# Altium project anti_theft_device_pcb.PrjPcb
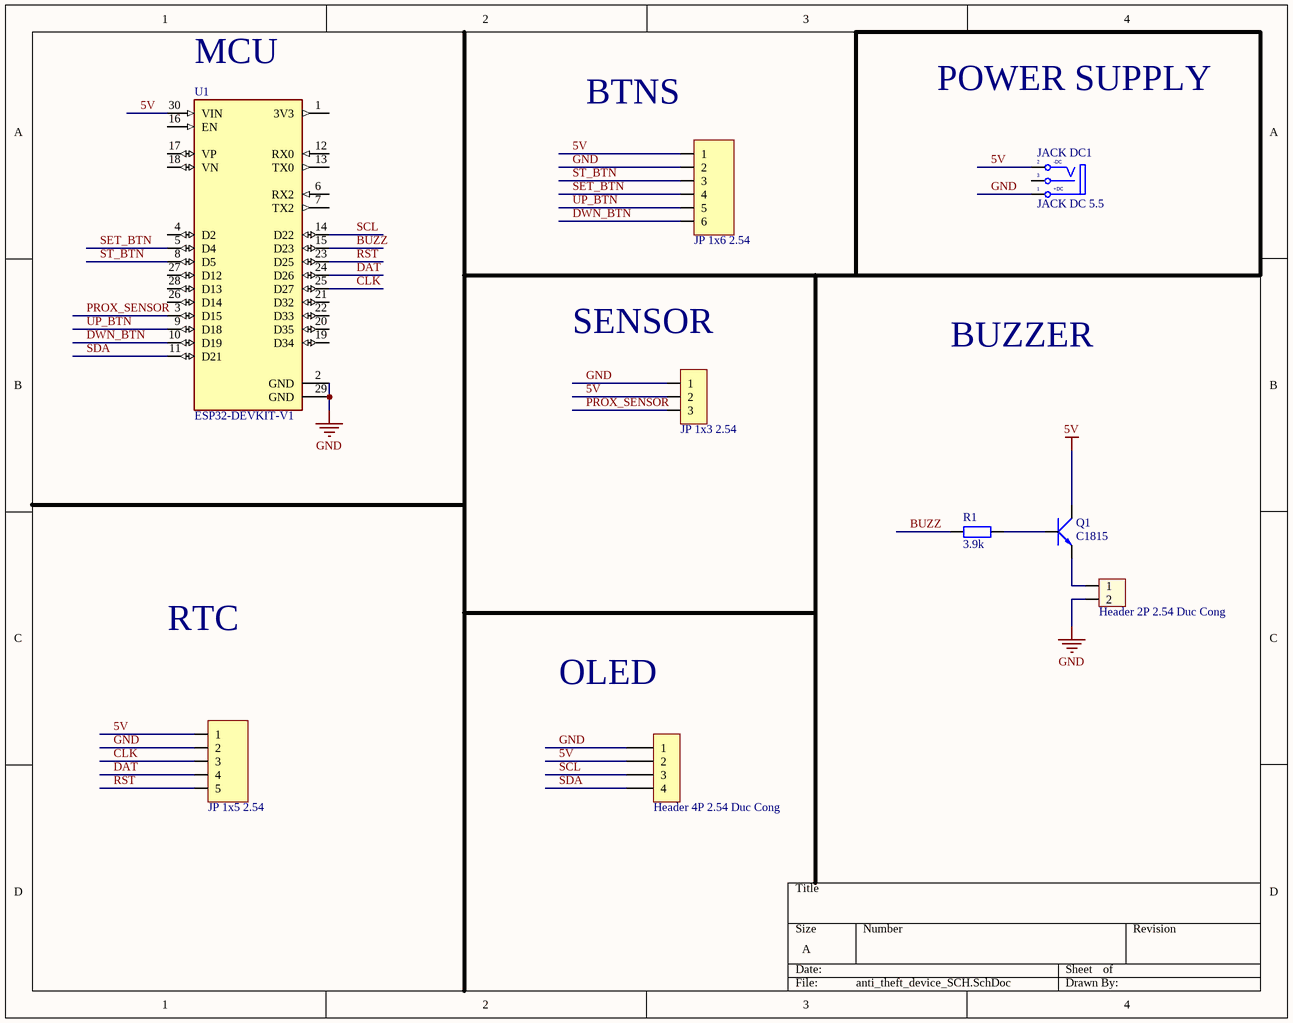
[diagram p0: anti_theft_device_SCH.SchDoc]
1 sheet, 9 parts. Net scope: global (net labels, ports and power ports of the same name join across sheets).
Board file: anti_theft_device_pcb_PCB.PcbDoc

## Sheet anti_theft_device_SCH.SchDoc
size A; SheetNumber: 1; SheetTotal: 1

### Parts
H1  Header 2P 2.54 Duc Cong  [Header 2P DC 2.54]
H2  Header 4P 2.54 Duc Cong  [Header 4P DC 2.54]
JACK_DC1  JACK DC 5.5  [JACK DC 5.5]
JP1  JP 1x6 2.54  [JP 1x6 CC]
JP2  JP 1x3 2.54  [JP 1x3 CT]
JP3  JP 1x5 2.54  [JP 1x5 CT]
Q1  C1815  [TO92]
R1  3.9k  [tro vach 1/4w]
U1  ESP32-DEVKIT-V1  [MODULE_ESP32_DEVKIT_V1]

### Nets
5V: H2.2 JACK_DC1.2(TN) JP1.1 JP2.2 JP3.1 Q1.2(C) U1.30(VIN)
GND: H1.2 H2.1 JACK_DC1.1(T) JP1.2 JP2.1 JP3.2 U1.2(GND) U1.29(GND)
BUZZ: R1.1 U1.15(D23)
CLK: JP3.3 U1.25(D27)
DAT: JP3.4 U1.24(D26)
DWN_BTN: JP1.6 U1.10(D19)
PROX_SENSOR: JP2.3 U1.3(D15)
RST: JP3.5 U1.23(D25)
SCL: H2.3 U1.14(D22)
SDA: H2.4 U1.11(D21)
SET_BTN: JP1.4 U1.5(D4)
ST_BTN: JP1.3 U1.8(D5)
UP_BTN: JP1.5 U1.9(D18)
NetH1_1: H1.1 Q1.1(E)
NetQ1_3: Q1.3(B) R1.2

Not connected (* = marked no-connect by the designer): JACK_DC1 3(S); U1 1(3V3) 4(D2) 6(RX2) 7(TX2) 12(RX0) 13(TX0) 16(EN) 17(VP) 18(VN) 19(D34) 20(D35) 21(D32) 22(D33) 26(D14) 27(D12) 28(D13)

### Notes on the sheet
- (near U1) MCU
- POWER SUPPLY
- (near JP1) BTNS
- (near JP2) SENSOR
- BUZZER
- RTC
- OLED
- (in symbol JACK DC 5.5) -DC; +DC

### Library data of the parts
H1 = Header 2P 2.54 Duc Cong: Cắm; Ten_Linh_Kien: Header 2P XH2.54-2P Đực Cong; Don_Vi: Con; Ma_Hang: MH002852; Chung_Loai: Cắm
H2 = Header 4P 2.54 Duc Cong: Cắm; Ten_Linh_Kien: Header 4P XH2.54-4P Đực Cong; Don_Vi: Con; Ma_Hang: MH001310; Chung_Loai: Cắm
JACK_DC1 = JACK DC 5.5: Value: Jac DC
JP1 = JP 1x6 2.54 Cai Cong: Cắm; Ten_Linh_Kien: Jump Đơn Cái 2.54MM 1x40P Cong; Don_Vi: Con; Ma_Hang: MH001265; Ghi_Chu: *; Kieu_Chan: *; Chung_Loai: Cắm
JP2 = JP 1x3 2.54 Cai Thang: Cắm; Ten_Linh_Kien: Jump Đơn Cái 2.54MM 1x20P Thẳng; Don_Vi: Con; Ma_Hang: MH004006; Ghi_Chu: *; Kieu_Chan: *; Chung_Loai: Cắm
JP3 = JP 1x5 2.54 Cai Thang: Cắm; Ten_Linh_Kien: Jump Đơn Cái 2.54MM 1x20P Thẳng; Don_Vi: Con; Ma_Hang: MH004006; Ghi_Chu: *; Kieu_Chan: *; Chung_Loai: Cắm
Q1 = Trans C1815 DIP: NPN transistor; Value: C9014
R1 = Tro Vach 1/4W 5% 9.1k: Cắm; Don_Vi: Con; So_Chan: 2; Ten_Linh_Kien: Trở Vạch 1/4w 5% 9.1k; Ma_Hang: MH008787; Chung_Loai: Cắm; Kieu_Chan: *
U1 = ESP32-DEVKIT-V1: Dual core, Wi-Fi: 2.4 GHz up to 150 Mbits/s,BLE (Bluetooth Low Energy) and legacy Bluetooth, 32 bits, Up to 240 MHz; MF: Do it; Price: None; Availability: Not in stock; Package: None; MP: ESP32-DEVKIT-V1; Value: *; SnapEDA_Link: https://www.snapeda.com/parts/ESP32-DEVKIT-V1/Do+it/view-part/?ref=snap; Check_prices: https://www.snapeda.com/parts/ESP32-DEVKIT-V1/Do+it/view-part/?ref=eda